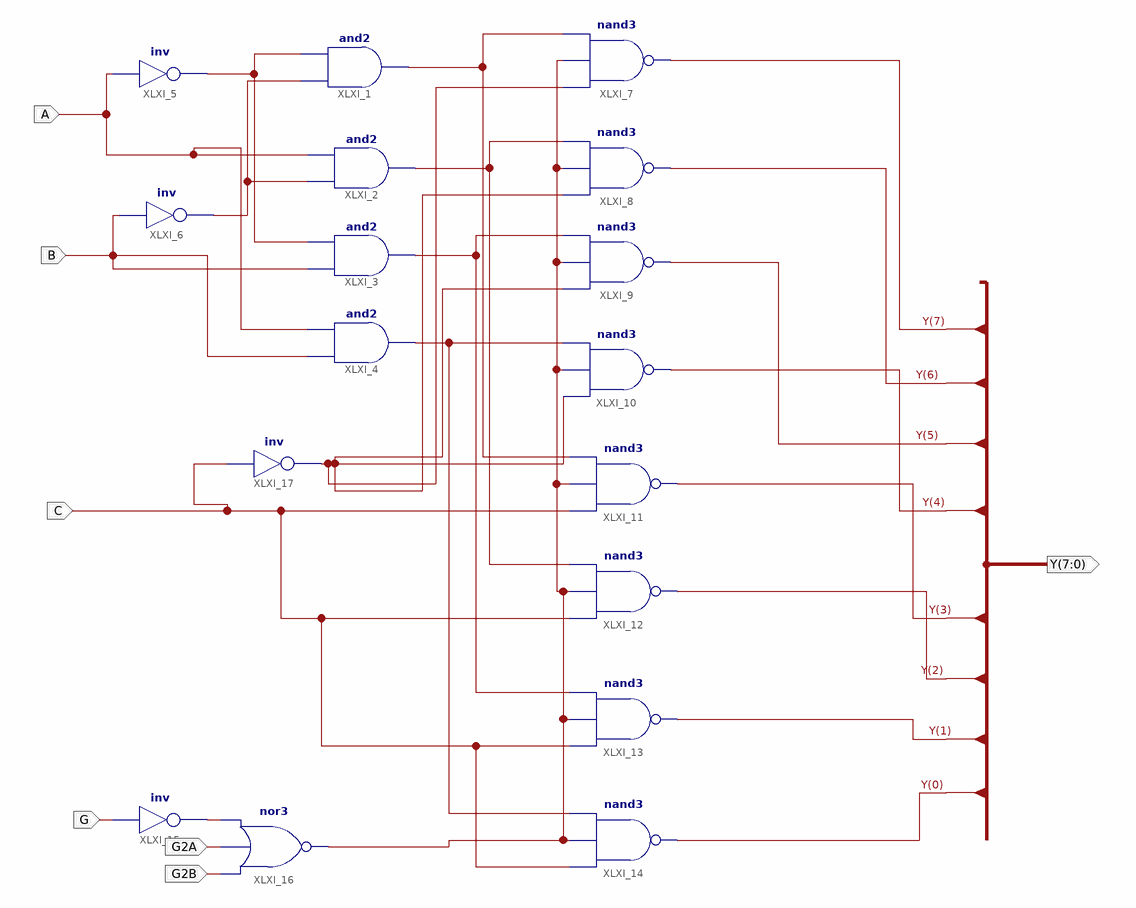
[diagram p0: schematic sheet 1]
// Xilinx ISE schematic D_74LS138.sch (kintex7) as structural Verilog: 17 symbols, 7 ports
module D_74LS138 (
  input  A,
  input  B,
  input  C,
  input  G,
  input  G2A,
  input  G2B,
  output [7:0] Y
);

  wire XLXN_4, XLXN_5, XLXN_6, XLXN_12, XLXN_14, XLXN_17, XLXN_18, XLXN_22, XLXN_50;

  and XLXI_1 (XLXN_6, XLXN_5, XLXN_4);
  and XLXI_2 (XLXN_12, XLXN_5, A);
  and XLXI_3 (XLXN_14, B, XLXN_4);
  and XLXI_4 (XLXN_17, B, A);
  not XLXI_5 (XLXN_4, A);
  not XLXI_6 (XLXN_5, B);
  nand XLXI_7 (Y[7], XLXN_22, XLXN_50, XLXN_6);
  nand XLXI_8 (Y[6], XLXN_22, XLXN_50, XLXN_12);
  nand XLXI_9 (Y[5], XLXN_22, XLXN_50, XLXN_14);
  nand XLXI_10 (Y[4], XLXN_22, XLXN_50, XLXN_17);
  nand XLXI_11 (Y[3], C, XLXN_50, XLXN_6);
  nand XLXI_12 (Y[2], C, XLXN_50, XLXN_12);
  nand XLXI_13 (Y[1], C, XLXN_50, XLXN_14);
  nand XLXI_14 (Y[0], C, XLXN_50, XLXN_17);
  not XLXI_15 (XLXN_18, G);
  nor XLXI_16 (XLXN_50, G2B, G2A, XLXN_18);
  not XLXI_17 (XLXN_22, C);
endmodule
